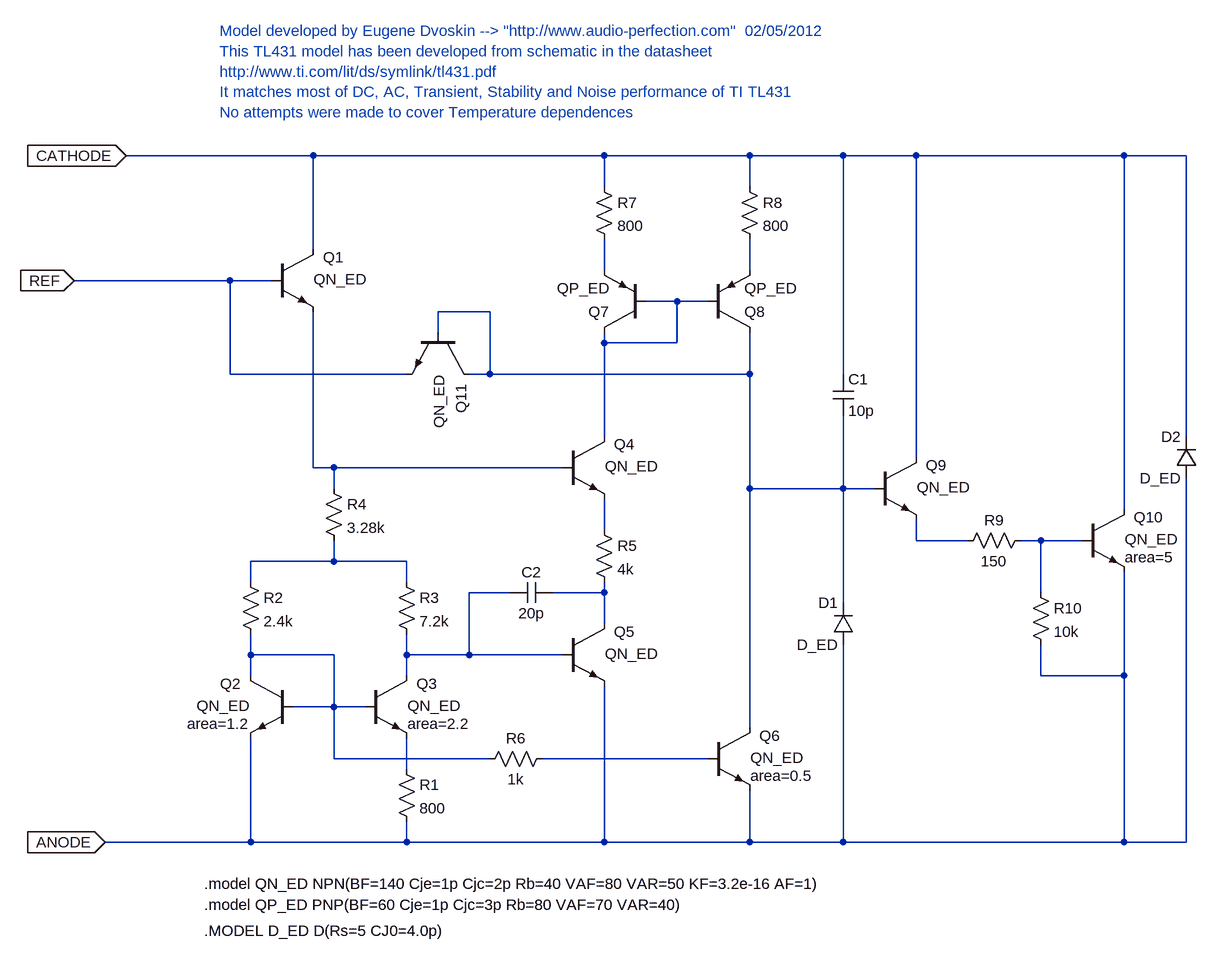
[diagram p0: schematic TL431ED.asc]
TL431ED.asc, the LTspice schematic file:
Version 4
SHEET 1 5780 1208
WIRE -512 -128 -800 -128
WIRE -64 -128 -512 -128
WIRE 160 -128 -64 -128
WIRE 304 -128 160 -128
WIRE 416 -128 304 -128
WIRE 736 -128 416 -128
WIRE 832 -128 736 -128
WIRE -64 -80 -64 -128
WIRE 160 -80 160 -128
WIRE -512 16 -512 -128
WIRE -64 48 -64 0
WIRE 160 48 160 0
WIRE -640 64 -880 64
WIRE -576 64 -640 64
WIRE 48 96 0 96
WIRE 96 96 48 96
WIRE -240 112 -320 112
WIRE -320 144 -320 112
WIRE -64 160 -64 144
WIRE 48 160 48 96
WIRE 48 160 -64 160
WIRE -640 208 -640 64
WIRE -368 208 -640 208
WIRE -240 208 -240 112
WIRE -240 208 -272 208
WIRE 160 208 160 144
WIRE 160 208 -240 208
WIRE 304 208 304 -128
WIRE -64 304 -64 160
WIRE 832 304 832 -128
WIRE 416 336 416 -128
WIRE -512 352 -512 112
WIRE -480 352 -512 352
WIRE -128 352 -480 352
WIRE -480 384 -480 352
WIRE 160 384 160 208
WIRE 304 384 304 272
WIRE 304 384 160 384
WIRE 352 384 304 384
WIRE 736 416 736 -128
WIRE -64 448 -64 400
WIRE 416 464 416 432
WIRE 496 464 416 464
WIRE 608 464 576 464
WIRE 672 464 608 464
WIRE -480 496 -480 464
WIRE -480 496 -608 496
WIRE -368 496 -480 496
WIRE -608 528 -608 496
WIRE -368 528 -368 496
WIRE -208 544 -272 544
WIRE -64 544 -64 528
WIRE -64 544 -144 544
WIRE 608 544 608 464
WIRE 304 560 304 384
WIRE -64 592 -64 544
WIRE -608 640 -608 608
WIRE -480 640 -608 640
WIRE -368 640 -368 608
WIRE -272 640 -272 544
WIRE -272 640 -368 640
WIRE -128 640 -272 640
WIRE -608 672 -608 640
WIRE -368 672 -368 640
WIRE 608 672 608 624
WIRE 736 672 736 512
WIRE 736 672 608 672
WIRE -480 720 -480 640
WIRE -480 720 -544 720
WIRE -432 720 -480 720
WIRE 160 752 160 384
WIRE -480 800 -480 720
WIRE -240 800 -480 800
WIRE 96 800 -160 800
WIRE -368 816 -368 768
WIRE -608 928 -608 768
WIRE -608 928 -832 928
WIRE -368 928 -368 896
WIRE -368 928 -608 928
WIRE -64 928 -64 688
WIRE -64 928 -368 928
WIRE 160 928 160 848
WIRE 160 928 -64 928
WIRE 304 928 304 624
WIRE 304 928 160 928
WIRE 736 928 736 672
WIRE 736 928 304 928
WIRE 832 928 832 368
WIRE 832 928 736 928
FLAG -800 -128 CATHODE
IOPIN -800 -128 In
FLAG -880 64 REF
IOPIN -880 64 In
FLAG -832 928 ANODE
IOPIN -832 928 In
SYMBOL npn -576 16 R0
WINDOW 0 79 12 Left 2
WINDOW 3 65 46 Left 2
WINDOW 123 65 74 Left 2
SYMATTR InstName Q1
SYMATTR Value QN_ED
SYMBOL pnp 0 144 R180
SYMATTR InstName Q7
SYMATTR Value QP_ED
SYMBOL diode 320 624 R180
WINDOW 0 24 64 Left 2
WINDOW 3 24 0 Left 2
SYMATTR InstName D1
SYMATTR Value D_ED
SYMBOL pnp 96 144 M180
SYMATTR InstName Q8
SYMATTR Value QP_ED
SYMBOL res -496 368 R0
SYMATTR InstName R4
SYMATTR Value 3.28k
SYMBOL res -624 512 R0
SYMATTR InstName R2
SYMATTR Value 2.4k
SYMBOL res -384 512 R0
SYMATTR InstName R3
SYMATTR Value 7.2k
SYMBOL res -384 800 R0
SYMATTR InstName R1
SYMATTR Value 800
SYMBOL res -80 432 R0
SYMATTR InstName R5
SYMATTR Value 4k
SYMBOL res -80 -96 R0
SYMATTR InstName R7
SYMATTR Value 800
SYMBOL res 144 -96 R0
SYMATTR InstName R8
SYMATTR Value 800
SYMBOL res -144 784 R90
WINDOW 0 0 56 VBottom 2
WINDOW 3 32 56 VTop 2
SYMATTR InstName R6
SYMATTR Value 1k
SYMBOL res 592 448 R90
WINDOW 0 0 56 VBottom 2
WINDOW 3 32 56 VTop 2
SYMATTR InstName R9
SYMATTR Value 150
SYMBOL res 592 528 R0
SYMATTR InstName R10
SYMATTR Value 10k
SYMBOL diode 848 368 R180
WINDOW 0 24 64 Left 2
WINDOW 3 24 0 Left 2
SYMATTR InstName D2
SYMATTR Value D_ED
SYMBOL cap 288 208 R0
SYMATTR InstName C1
SYMATTR Value 10p
SYMBOL cap -208 560 R270
WINDOW 0 32 32 VTop 2
WINDOW 3 0 32 VBottom 2
SYMATTR InstName C2
SYMATTR Value 20p
SYMBOL npn -544 672 M0
WINDOW 0 79 12 Left 2
WINDOW 3 65 46 Left 2
WINDOW 123 65 74 Left 2
SYMATTR InstName Q2
SYMATTR Value QN_ED
SYMATTR Value2 area=1.2
SYMBOL npn -432 672 R0
WINDOW 0 79 12 Left 2
WINDOW 3 65 46 Left 2
WINDOW 123 65 74 Left 2
SYMATTR InstName Q3
SYMATTR Value QN_ED
SYMATTR Value2 area=2.2
SYMBOL npn -128 592 R0
WINDOW 0 79 12 Left 2
WINDOW 3 65 46 Left 2
WINDOW 123 70 77 Left 2
SYMATTR InstName Q5
SYMATTR Value QN_ED
SYMBOL npn 352 336 R0
WINDOW 0 79 12 Left 2
WINDOW 3 65 46 Left 2
WINDOW 123 65 74 Left 2
SYMATTR InstName Q9
SYMATTR Value QN_ED
SYMBOL npn 672 416 R0
WINDOW 0 79 12 Left 2
WINDOW 3 65 46 Left 2
WINDOW 123 65 74 Left 2
SYMATTR InstName Q10
SYMATTR Value QN_ED
SYMATTR Value2 area=5
SYMBOL npn -128 304 R0
WINDOW 0 79 12 Left 2
WINDOW 3 65 46 Left 2
WINDOW 123 70 77 Left 2
SYMATTR InstName Q4
SYMATTR Value QN_ED
SYMBOL npn 96 752 R0
WINDOW 0 79 12 Left 2
WINDOW 3 65 46 Left 2
WINDOW 123 65 74 Left 2
SYMATTR InstName Q6
SYMATTR Value QN_ED
SYMATTR Value2 area=0.5
SYMBOL npn -272 144 R90
WINDOW 0 79 12 Left 2
WINDOW 3 65 46 Left 2
WINDOW 123 70 77 Left 2
SYMATTR InstName Q11
SYMATTR Value QN_ED
TEXT -680 992 Left 2 !.model QN_ED NPN(BF=140 Cje=1p Cjc=2p Rb=40 VAF=80 VAR=50 KF=3.2e-16 AF=1)
TEXT -680 1024 Left 2 !.model QP_ED PNP(BF=60 Cje=1p Cjc=3p Rb=80 VAF=70 VAR=40)
TEXT -680 1064 Left 2 !.MODEL D_ED D(Rs=5 CJ0=4.0p)
TEXT -656 -320 Left 2 ;Model developed by Eugene Dvoskin --> "http://www.audio-perfection.com"  02/05/2012\nThis TL431 model has been developed from schematic in the datasheet\nhttp://www.ti.com/lit/ds/symlink/tl431.pdf\nIt matches most of DC, AC, Transient, Stability and Noise performance of TI TL431\nNo attempts were made to cover Temperature dependences

The netlist it stands for:
* TL431ED.asc
Q1 CATHODE REF N005 0 QN_ED
Q7 N003 N003 N001 0 QP_ED
D1 ANODE N004 D_ED
Q8 N004 N003 N002 0 QP_ED
R4 N005 N009 3.28k
R2 N009 N012 2.4k
R3 N009 N010 7.2k
R1 N014 ANODE 800
R5 N006 N011 4k
R7 CATHODE N001 800
R8 CATHODE N002 800
R6 N013 N012 1k
R9 N008 N007 150
R10 N008 ANODE 10k
D2 ANODE CATHODE D_ED
C1 CATHODE N004 10p
C2 N010 N011 20p
Q2 N012 N012 ANODE 0 QN_ED area=1.2
Q3 N010 N012 N014 0 QN_ED area=2.2
Q5 N011 N010 ANODE 0 QN_ED
Q9 CATHODE N004 N007 0 QN_ED
Q10 CATHODE N008 ANODE 0 QN_ED area=5
Q4 N003 N005 N006 0 QN_ED
Q6 N004 N013 ANODE 0 QN_ED area=0.5
Q11 N004 N004 REF 0 QN_ED
.model D D
.lib standard.dio
.model NPN NPN
.model PNP PNP
.lib standard.bjt
.model QN_ED NPN(BF=140 Cje=1p Cjc=2p Rb=40 VAF=80 VAR=50 KF=3.2e-16 AF=1)
.model QP_ED PNP(BF=60 Cje=1p Cjc=3p Rb=80 VAF=70 VAR=40)
.MODEL D_ED D(Rs=5 CJ0=4.0p)
* Model developed by Eugene Dvoskin --> "http://www.audio-perfection.com"  02/05/2012
* This TL431 model has been developed from schematic in the datasheet
* http://www.ti.com/lit/ds/symlink/tl431.pdf
* It matches most of DC, AC, Transient, Stability and Noise performance of TI TL431
* No attempts were made to cover Temperature dependences
.backanno
.end